# Altium project Invertor_controller_v2.PrjPcb (part 3 of 3)

## Sheet 400vMonitor.SchDoc
size A4
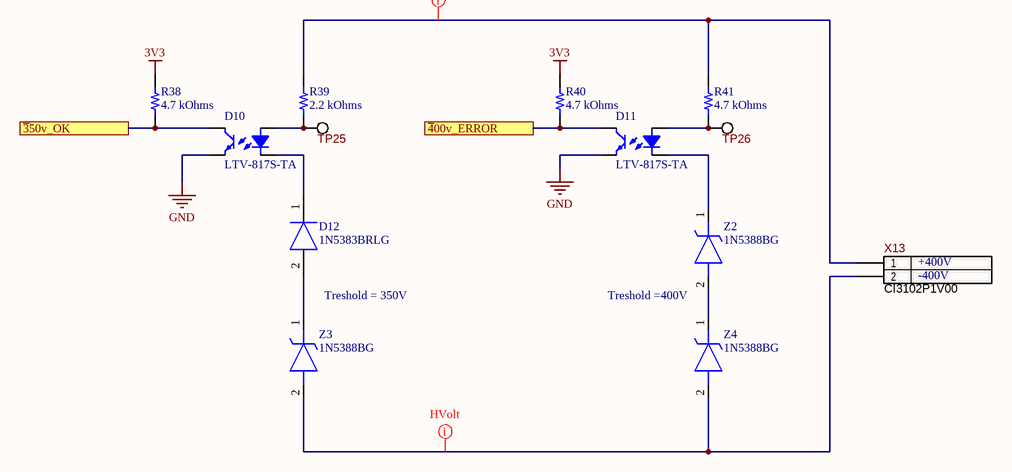
[diagram p9: 400vMonitor.SchDoc]

### Parts
D10  LTV-817S-TA  [LITEON LTV-817]
D11  LTV-817S-TA  [LITEON LTV-817]
D12  1N5383BRLG  [DIOAD2260W109L864D349]
R38  4.7 kOhms  [RES 0805_2012]
R39  2.2 kOhms  [RES 0805_2012]
R40  4.7 kOhms  [RES 0805_2012]
R41  4.7 kOhms  [RES 0805_2012]
TP25  PAD-1.1mm  [PAD-1.1mm]  (value not drawn)  (no BOM)
TP26  PAD-1.1mm  [PAD-1.1mm]  (value not drawn)  (no BOM)
X13  WH-02S  [WF-2S]  (value not drawn)
Z2  1N5388BG  [DIOAD2260W109L864D349]
Z3  1N5388BG  [DIOAD2260W109L864D349]
Z4  1N5388BG  [DIOAD2260W109L864D349]

### Ports
~{3}50v_OK, ~{4}00v_ERROR

### Nets
3V3: R38.2 R40.2
GND: D10.3 D11.3
350V_State: D10.4 R38.1 ; port ~{3}50v_OK
400V_State: D11.4 R40.1 ; port ~{4}00v_ERROR
NetD10_1: D10.1 R39.1 TP25.1
NetD10_2: D10.2 D12.1(K)
NetD11_1: D11.1 R41.1 TP26.1
NetD11_2: D11.2 Z2.1(K)
NetD12_2: D12.2(A) Z3.1(K)
NetR39_2: R39.2 R41.2 X13.1
NetX13_2: X13.2 Z3.2(A) Z4.2(A)
NetZ2_2: Z2.2(A) Z4.1(K)

### Layout directives
net class HVOLT: NetR39_2, NetX13_2

### Notes on the sheet
- (near X13) +400V
- (near X13) -400V
- Treshold = 350V
- Treshold =400V

### Library data of the parts
D10 D11 = LTV-817S-TA: OPTOISOLATR 5KV TRANSISTOR 4-SMD; Manufacturer: Lite-On Inc.; Current - DC Forward (If) (Max): 50mA; Current Transfer Ratio (Max): 600% @ 5mA; Current Transfer Ratio (Min): 50% @ 5mA; Input Type: DC; Number of Channels: 1; Rise / Fall Time (Typ): 4µs, 3µs; Vce Saturation (Max): 200mV; Voltage - Forward (Vf) (Typ): 1.2V; Voltage - Isolation: 5000Vrms; Voltage - Output (Max): 35V; Part Number: LTV-817S-TA; ComponentLink1Description: Datasheet; ComponentLink1URL: http://optoelectronics.liteon.com/upload/download/DS-70-96-0016/LTV-8X7%20series%20201610%20.pdf; ComponentLink2Description: DigiKey Link; ComponentLink2URL: http://digikey.com/product-detail/en/lite-on-inc/LTV-817S-TA/160-2038-1-ND/3711420; Current - Output / Channel: 50mA; Device Package: 4-SMD, Gull Wing; LastUpdated: 12.01.2020 21:59:02; Lifecycle Status: Active; Minimum Order: 1; Mounting Type: Surface Mount; Operating Temperature: -30°C ~ 110°C; Output Type: Transistor; Package / Case: 4-SMD, Gull Wing; Packaging: TapeAndReel; Part Status: Active; Price: 0.12; Series: -; Supplier 1: DigiKey; Supplier Part Number 1: 160-2038-1-ND; Supplier Device Package: 4-SMD
D12 = 1N5383BRLG: Diode; Manufacturer_Name: ON Semiconductor; Datasheet Link: https://datasheet.datasheetarchive.com/originals/distributors/Datasheets-23/DSA-455187.pdf; Manufacturer_Part_Number: 1N5383BRLG; Mouser Part Number: 863-1N5383BRLG; Mouser Price/Stock: https://www.mouser.co.uk/ProductDetail/onsemi/1N5383BRLG?qs=y2kkmE52mdNEksVZLCVE%252BQ%3D%3D; Arrow Part Number: 1N5383BRLG; Arrow Price/Stock: https://www.arrow.com/en/products/1n5383brlg/on-semiconductor
R38 R40 R41 = RCS08054K70JNEA: RES SMD 4.7K OHM 5% 0.4W 0805; Manufacturer: Vishay Dale; Power (Watts): 0.4W, 2/5W; Temperature Coefficient: ±200ppm/°C; Part Number: RCS08054K70JNEA; Value: 4.7 kOhms; ComponentLink1Description: Datasheet; ComponentLink1URL: http://www.vishay.com/docs/20065/rcse3.pdf; ComponentLink2Description: DigiKey Link; ComponentLink2URL: http://digikey.com/product-detail/en/vishay-dale/RCS08054K70JNEA/541-2866-1-ND/5867159; Composition: Thick Film; Device Package: 0805 (2012 Metric); Features: Automotive AEC-Q200, Pulse Withstanding; Height - Seated (Max): 0.020" (0.50mm); LastUpdated: 02.09.2020 01:15:24; Lifecycle Status: Active; Minimum Order: 1; Number of Terminations: 2; Operating Temperature: -55°C ~ 155°C; Package / Case: 0805 (2012 Metric); Packaging: TapeAndReel; PartId: 27839; Part Status: Active; Price: 0.02; Ratings: AEC-Q200; Resistance: 4.7 kOhms; Series: RCS e3; Size / Dimension: 0.079" L x 0.049" W (2.00mm x 1.25mm); Supplier 1: DigiKey; Supplier Part Number 1: 541-2866-1-ND; Supplier Device Package: 0805; Tolerance: ±5%
R39 = SR0805JR-7W2K2L: RES SMD 2.2K OHM 5% 1/4W 0805; Manufacturer: Yageo; Power (Watts): 0.25W, 1/4W; Temperature Coefficient: ±200ppm/°C; Part Number: SR0805JR-7W2K2L; Value: 2.2 kOhms; ComponentLink1Description: Datasheet; ComponentLink1URL: http://www.yageo.com/documents/recent/PYu-SR_20105_RoHS_L_8.pdf; ComponentLink2Description: DigiKey Link; ComponentLink2URL: http://digikey.com/product-detail/en/yageo/SR0805JR-7W2K2L/YAG6054CT-ND/9696508; Composition: Thick Film; Device Package: 0805 (2012 Metric); Features: Automotive AEC-Q200, Pulse Withstanding; Height - Seated (Max): 0.024" (0.60mm); LastUpdated: 02.09.2020 01:15:24; Lifecycle Status: Active; Minimum Order: 1; Number of Terminations: 2; Operating Temperature: -55°C ~ 155°C; Package / Case: 0805 (2012 Metric); Packaging: TapeAndReel; PartId: 27793; Part Status: Active; Price: 0.03; Ratings: AEC-Q200; Resistance: 2.2 kOhms; Series: SR; Size / Dimension: 0.079" L x 0.049" W (2.00mm x 1.25mm); Supplier 1: DigiKey; Supplier Part Number 1: YAG6054CT-ND; Supplier Device Package: 0805; Tolerance: ±5%
TP25 TP26 = PAD-1.1mm: 1.1mm Pad for Plug-In or Receptacle; Ajax_1C_PN: NONE; Ajax_1С_Status: RND Only; Component Status: Released; Lifecycle: ="Lifecycle"; Part Number: PAD-1.1mm; Component Type: PTH; Manufacturer: NONE; Part Type: Pad; Temperature Range: NONE; ComponentLink1URL: NONE; Replacement: NONE; Price: NONE; ComponentLink1Description: Datasheet
X13 = CI3102P1V00: WH Series 2.54mm Wire to Board Straight DIP Type Headers, 2 Pin; Manufacturer: CviLux; Ajax_1C_ID: 6817; Ajax_1C_PN: WF-02S (DS1070-2M) Штекер "папа"; 2 контакта; шаг 2.54мм; прямой; на плату; Ajax_1С_Status: RND Only; Component Status: Released; Replacement: NONE; GUID_1C: 74812bc3-35d6-11e5-ad28-a45d36c4a9e5; Part Number: CI3102P1V00; Part Type: Wire-to-Board / Header; Component Type: PTH; Temperature Range: -25℃ ~ 85℃; ComponentLink1URL: https://www.cvilux.com/uploads/drawings/100/723/CI3102S.pdf; Price: 0.08872458; ComponentLink1Description: Datasheet
Z2-Z4 = 1N5388BG: Zener Diode; Manufacturer_Name: ON Semiconductor; Datasheet Link: https://datasheet.datasheetarchive.com/originals/distributors/SFDatasheet-3/sf-00075052.pdf; Manufacturer_Part_Number: 1N5388BG; Mouser Part Number: 863-1N5388BG; Mouser Price/Stock: https://www.mouser.co.uk/ProductDetail/ON-Semiconductor/1N5388BG?qs=y2kkmE52mdMKKo8v3zoSgw%3D%3D; Arrow Part Number: 1N5388BG; Arrow Price/Stock: https://www.arrow.com/en/products/1n5388bg/on-semiconductor

## Sheet DC-DC_Protection.SchDoc
size A4
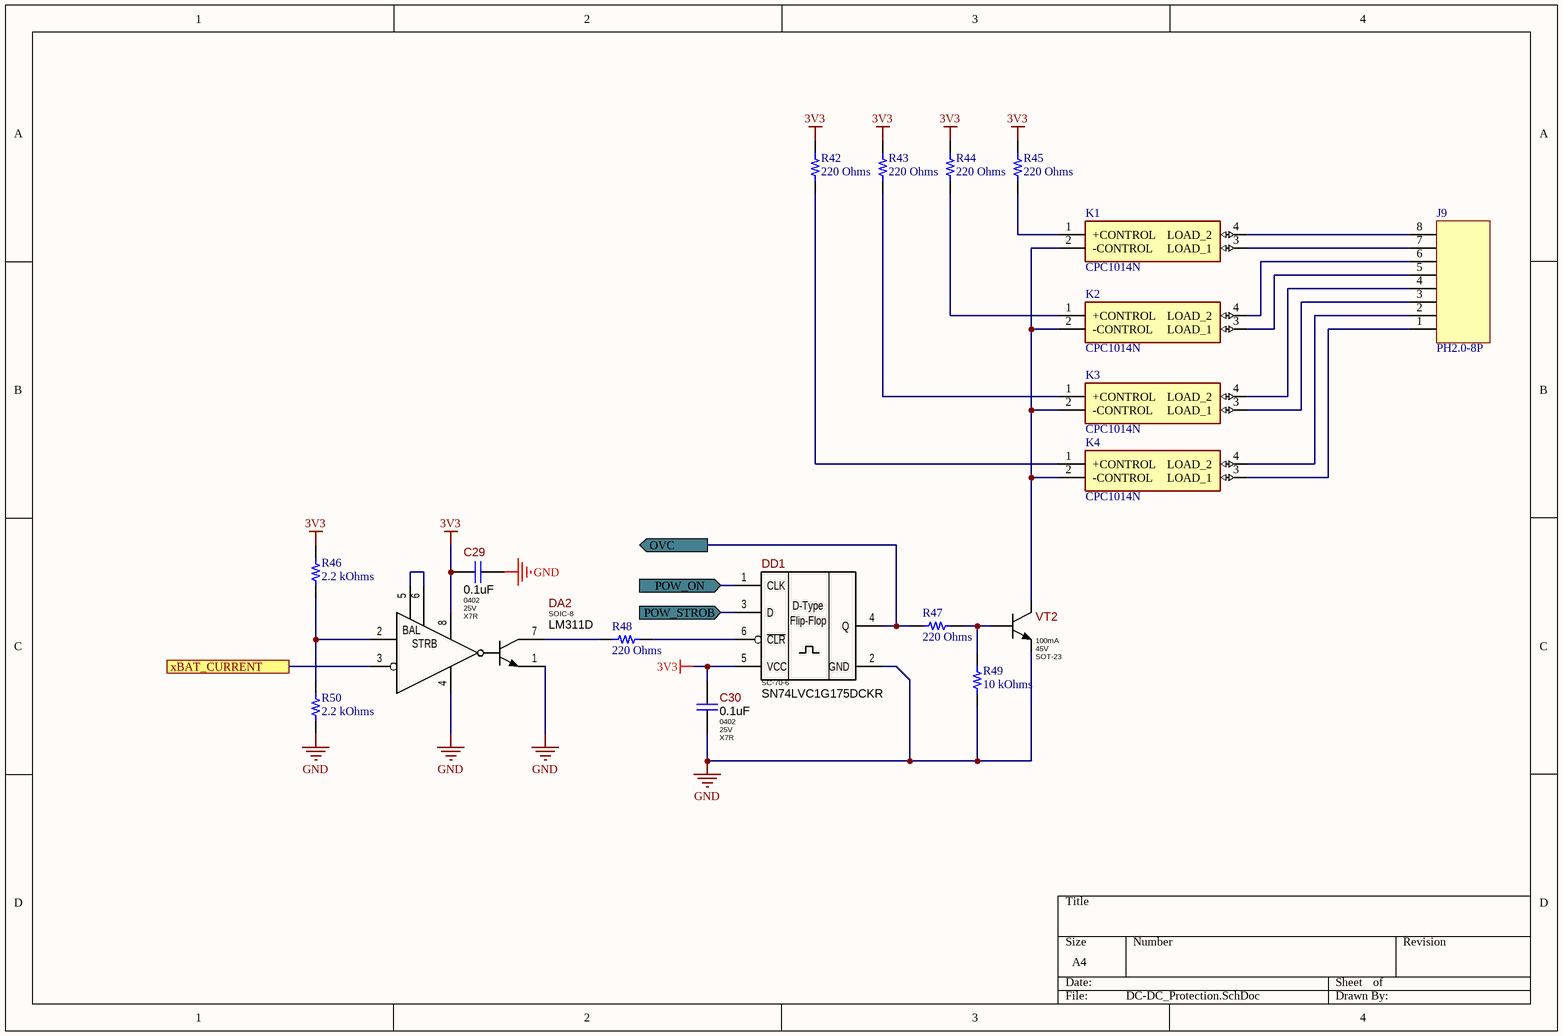
[diagram p10: DC-DC_Protection.SchDoc]

### Parts
C29  Package: 0402  Voltage: 25V  Dielectric Type: X7R  [C_CERAMIC_0402_MED]  (hidden comment: 0.1uF)
C30  Package: 0402  Voltage: 25V  Dielectric Type: X7R  [C_CERAMIC_0402_MED]  (hidden comment: 0.1uF)
DA2  Package: SOIC-8  [SOIC-8_W3.9MM]  (hidden comment: LM311D)
DD1  SN74LVC1G175DCKR  [SC-70-6]
J9  PH2.0-8P  [PH2.0-8P]
K1  CPC1014N  [SOP254P610X218-4N]
K2  CPC1014N  [SOP254P610X218-4N]
K3  CPC1014N  [SOP254P610X218-4N]
K4  CPC1014N  [SOP254P610X218-4N]
R42  220 Ohms  [RES 0805_2012]
R43  220 Ohms  [RES 0805_2012]
R44  220 Ohms  [RES 0805_2012]
R45  220 Ohms  [RES 0805_2012]
R46  2.2 kOhms  [RES 0805_2012]
R47  220 Ohms  [RES 0805_2012]
R48  220 Ohms  [RES 0805_2012]
R49  10 kOhms  [RES 0805_2012]
R50  2.2 kOhms  [RES 0805_2012]
VT2  Ic: 100mA  Vce: 45V  Package: SOT-23  [SOT-23_MED]  (hidden comment: BC847B)

### Ports
OVC (out), POW_ON (in), POW_STROB (in), xBAT_CURRENT

### Nets
3V3: C29.1 C30.1 DA2.8(VCC) DD1.5(VCC) R42.2 R43.2 R44.2 R45.2 R46.2
GND: C29.2 C30.2 DA2.1(EMIT_OUT) DA2.4(GND) DD1.2(GND) R49.1 R50.1 VT2.2(E)
24V_DC_OVC_SIG: DD1.4(Q) R47.1 ; port OVC
cEN_24V: DD1.1(CLK) ; port POW_ON
cPOWER_STROB: DD1.3(D) ; port POW_STROB
xBAT_CURRENT: DA2.3(IN-) ; port xBAT_CURRENT
NetDA2_2: DA2.2(IN+) R46.1 R50.2
NetDA2_5: DA2.5(BALANCE) DA2.6(BAL/STRB)
NetDA2_7: DA2.7(COL_OUT) R48.1
NetDD1_6: DD1.6(~{CLR}) R48.2
NetJ9_1: J9.1 K4.3(LOAD_1)
NetJ9_2: J9.2 K4.4(LOAD_2)
NetJ9_3: J9.3 K3.3(LOAD_1)
NetJ9_4: J9.4 K3.4(LOAD_2)
NetJ9_5: J9.5 K2.3(LOAD_1)
NetJ9_6: J9.6 K2.4(LOAD_2)
NetJ9_7: J9.7 K1.3(LOAD_1)
NetJ9_8: J9.8 K1.4(LOAD_2)
NetK1_1: K1.1(+CONTROL) R45.1
NetK1_2: K1.2(-CONTROL) K2.2(-CONTROL) K3.2(-CONTROL) K4.2(-CONTROL) VT2.3(C)
NetK2_1: K2.1(+CONTROL) R44.1
NetK3_1: K3.1(+CONTROL) R43.1
NetK4_1: K4.1(+CONTROL) R42.1
NetR47_2: R47.2 R49.2 VT2.1(B)

### Notes on the sheet
- (in symbol LM311D) BAL; STRB
- (in symbol SN74LVC1G175DCKR) D-Type; Flip-Flop

### Library data of the parts
C29 C30 = GRM155R71E104KE14D: 100nF 25V X7R ±10% 0402 Ceramic Capacitor RoHS; Manufacturer: Murata Electronics; Ajax_1C_ID: 7993; Ajax_1C_PN: 100nF 25V X7R 10% 0402 GRM155R71E104KE14D Ceramic Capacitor SMD RoHS; Standard Lead Time: 15 Weeks; Replacement: NONE; Value: 0.1uF; Part Number: GRM155R71E104KE14D; Lifecycle: Mass Production; Part Type: Ceramic / X7R / 0402; Component Type: SMD; Temperature Range: -55°C ~ 125°C; Tolerance: ±10%; ComponentLink1URL: https://search.murata.co.jp/Ceramy/image/img/A01X/G101/ENG/GRM155R71E104KE14-01.pdf; Supplier 1: Digi-Key; Supplier Part Number 1: 490-10698-1-ND; ComponentLink1Description: Datasheet
DA2 = LM311D: Differential General Purpose Comparator with Open-Collector, Open-Emitter, SOIC-8; Manufacturer: Texas Instruments; Ajax_1C_ID: 11065; Ajax_1C_PN: LM311D SO8, микросхема; Ajax_1С_Status: RND Only; Standard Lead Time: 6 Weeks; Component Status: On Review; Replacement: NONE; GUID_1C: 9c0f62f0-bfd1-11e7-8199-14dda9d2d04d; Part Number: LM311D; Part Type: Comparator; Component Type: SMD; Temperature Range: 0°C ~ 70°C; ComponentLink1URL: https://www.ti.com/lit/ds/symlink/lm311.pdf; Supplier 1: Digi-Key; Supplier Part Number 1: 296-1388-5-ND; Price: 0.15; ComponentLink1Description: Datasheet
DD1 = SN74LVC1G175DCKR: Single D-type Flip-Flop with Asynchronous Clear, Positive Edge Trigger, SC-70-6; Manufacturer: Texas Instruments; Ajax_1C_ID: 25389; Ajax_1C_PN: SN74LVC1G175DCKR (SC70-6) микросхема; Standard Lead Time: 6 Weeks; Replacement: NONE; Package: SC-70-6; Part Number: SN74LVC1G175DCKR; Part Type: Logic; Component Type: SMD; Lifecycle: RND Only; Temperature Range: -40°C ~ 125°C; ComponentLink1URL: https://www.ti.com/lit/ds/symlink/sn74lvc1g175.pdf?HQS=dis-dk-null-digikeymode-dsf-pf-null-wwe&ts=1622018232841; Supplier 1: Digi-Key; Supplier Part Number 1: 296-16998-2-ND; ComponentLink1Description: Datasheet
K1-K4 = CPC1014N: Relay or Contactor; Manufacturer_Name: LITTELFUSE; Datasheet Link: https://datasheet.datasheetarchive.com/originals/distributors/Datasheets-DGA15/691004.pdf; Height: 2.184mm; Manufacturer_Part_Number: CPC1014N; Mouser Part Number: 849-CPC1014N; Mouser Price/Stock: https://www.mouser.co.uk/ProductDetail/IXYS-Integrated-Circuits/CPC1014N?qs=OpMkDkHXivPNK7%252BhCXwefA%3D%3D; Arrow Part Number: CPC1014N; Arrow Price/Stock: https://www.arrow.com/en/products/cpc1014n/ixys
R42-R45 R47 = ESR10EZPF2200: RES SMD 220 OHM 1% 0.4W 0805; Manufacturer: Rohm Semiconductor; Power (Watts): 0.4W, 2/5W; Temperature Coefficient: ±100ppm/°C; Part Number: ESR10EZPF2200; Value: 220 Ohms; ComponentLink1Description: Datasheet; ComponentLink1URL: https://www.rohm.com/datasheet/ESR01MZPF/esr-e; ComponentLink2Description: DigiKey Link; ComponentLink2URL: http://digikey.com/product-detail/en/rohm-semiconductor/ESR10EZPF2200/RHM220AECT-ND/1983835; Composition: Thick Film; Device Package: 0805 (2012 Metric); Features: Automotive AEC-Q200, Pulse Withstanding; Height - Seated (Max): 0.026" (0.65mm); LastUpdated: 02.09.2020 01:15:23; Lifecycle Status: Active; Minimum Order: 1; Number of Terminations: 2; Operating Temperature: -55°C ~ 155°C; Package / Case: 0805 (2012 Metric); Packaging: TapeAndReel; PartId: 28037; Part Status: Active; Price: 0.02; Ratings: AEC-Q200; Resistance: 220 Ohms; Series: ESR; Size / Dimension: 0.079" L x 0.049" W (2.00mm x 1.25mm); Supplier 1: DigiKey; Supplier Part Number 1: RHM220AECT-ND; Supplier Device Package: 0805; Tolerance: ±1%
R46 R50 = SR0805JR-7W2K2L: as R39 on sheet 400vMonitor; Part Number: SR0805JR-7W2K2L; Value: 2.2 kOhms; ComponentLink1Description: Datasheet; ComponentLink1URL: http://www.yageo.com/documents/recent/PYu-SR_20105_RoHS_L_8.pdf; ComponentLink2Description: DigiKey Link; ComponentLink2URL: http://digikey.com/product-detail/en/yageo/SR0805JR-7W2K2L/YAG6054CT-ND/9696508; Composition: Thick Film; Device Package: 0805 (2012 Metric); Features: Automotive AEC-Q200, Pulse Withstanding; Height - Seated (Max): 0.024" (0.60mm); LastUpdated: 02.09.2020 01:15:24; Lifecycle Status: Active; Minimum Order: 1; Number of Terminations: 2; Operating Temperature: -55°C ~ 155°C; Package / Case: 0805 (2012 Metric); Packaging: TapeAndReel; PartId: 27793; Part Status: Active; Price: 0.03; Ratings: AEC-Q200; Resistance: 2.2 kOhms; Series: SR; Size / Dimension: 0.079" L x 0.049" W (2.00mm x 1.25mm); Supplier 1: DigiKey; Supplier Part Number 1: YAG6054CT-ND; Supplier Device Package: 0805; Tolerance: ±5%
R48 = CRGP0805F220R: CRGP 0805 220R 1%; Manufacturer: TE Connectivity Passive Product; Power (Watts): 0.333W, 1/3W; Temperature Coefficient: ±100ppm/°C; Part Number: CRGP0805F220R; Value: 220 Ohms; ComponentLink1Description: Datasheet; ComponentLink1URL: https://www.te.com/commerce/DocumentDelivery/DDEController?Action=srchrtrv&DocNm=9-1773463-9&DocType=DS&DocLang=English; ComponentLink2Description: DigiKey Link; ComponentLink2URL: http://digikey.com/product-detail/en/te-connectivity-passive-product/CRGP0805F220R/A130469CT-ND/8578301; Composition: Thick Film; Device Package: 0805 (2012 Metric); Features: Pulse Withstanding; Height - Seated (Max): 0.026" (0.65mm); LastUpdated: 02.09.2020 01:15:22; Lifecycle Status: Active; Minimum Order: 1; Number of Terminations: 2; Operating Temperature: -55°C ~ 155°C; Package / Case: 0805 (2012 Metric); Packaging: TapeAndReel; PartId: 28799; Part Status: Active; Price: 0.02; Resistance: 220 Ohms; Series: CRGP; Size / Dimension: 0.079" L x 0.049" W (2.00mm x 1.25mm); Supplier 1: DigiKey; Supplier Part Number 1: A130469CT-ND; Supplier Device Package: 0805; Tolerance: ±1%
R49 = RNCS0805BKE10K0: RES 10K OHM 0.1% 1/10W 0805; Manufacturer: Stackpole Electronics Inc; Power (Watts): 0.1W, 1/10W; Temperature Coefficient: ±25ppm/°C; Part Number: RNCS0805BKE10K0; Value: 10 kOhms; ComponentLink1Description: Datasheet; ComponentLink1URL: https://www.seielect.com/catalog/sei-rncs_rnch.pdf; ComponentLink2Description: DigiKey Link; ComponentLink2URL: http://digikey.com/product-detail/en/stackpole-electronics-inc/RNCS0805BKE10K0/RNCS0805BKE10K0CT-ND/1800164; Composition: Thin Film; Device Package: 0805 (2012 Metric); Features: Anti-Corrosive, Automotive AEC-Q200, Moisture Resistant; Height - Seated (Max): 0.026" (0.65mm); LastUpdated: 02.09.2020 01:15:24; Lifecycle Status: Active; Minimum Order: 1; Number of Terminations: 2; Operating Temperature: -55°C ~ 155°C; Package / Case: 0805 (2012 Metric); Packaging: TapeAndReel; PartId: 27713; Part Status: Active; Price: 0.09; Ratings: AEC-Q200; Resistance: 10 kOhms; Series: RNCS; Size / Dimension: 0.079" L x 0.049" W (2.00mm x 1.25mm); Supplier 1: DigiKey; Supplier Part Number 1: RNCS0805BKE10K0CT-ND; Supplier Device Package: 0805; Tolerance: ±0.1%
VT2 = BC847B,215: 45V, 100mA NPN General Purpose Transistor; Manufacturer: Nexperia USA Inc.; Ajax_1C_PN: NONE; Standard Lead Time: 4 Weeks; Part Type: NPN; Component Type: SMD; Lifecycle: RND Only; Temperature Range: -65°C ~ 150°C; ComponentLink1URL: https://assets.nexperia.com/documents/data-sheet/BC847_SER.pdf; Supplier 1: Digi-Key; Supplier Part Number 1: 1727-2921-2-ND; Replacement: NONE; ComponentLink1Description: Datasheet

## Sheet ULN2003_Drv.SchDoc
size A4
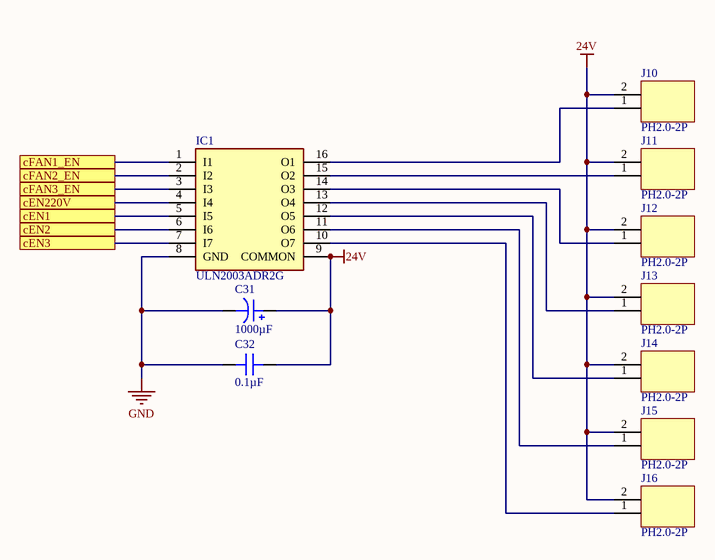
[diagram p11: ULN2003_Drv.SchDoc]

### Parts
C31  1000µF  [CAP TH ALUM ELEC D22.00mm S10.00mm H27.00mm]
C32  0.1µF  [CAP 0805_2012]
IC1  ULN2003ADR2G  [SOIC127P600X175-16N]
J10  PH2.0-2P  [PH2.0-2P]
J11  PH2.0-2P  [PH2.0-2P]
J12  PH2.0-2P  [PH2.0-2P]
J13  PH2.0-2P  [PH2.0-2P]
J14  PH2.0-2P  [PH2.0-2P]
J15  PH2.0-2P  [PH2.0-2P]
J16  PH2.0-2P  [PH2.0-2P]

### Ports
cEN1, cEN2, cEN3, cEN220V, cFAN1_EN, cFAN2_EN, cFAN3_EN

### Nets
24V: C31.1 C32.1 IC1.9(COMMON) J10.2 J11.2 J12.2 J13.2 J14.2 J15.2 J16.2
GND: C31.2 C32.2 IC1.8(GND)
cEN220V: IC1.4(I4) ; port cEN220V
cFAN1_EN: IC1.1(I1) ; port cFAN1_EN
cFAN2_EN: IC1.2(I2) ; port cFAN2_EN
cFAN3_EN: IC1.3(I3) ; port cFAN3_EN
NetIC1_5: IC1.5(I5) ; port cEN1
NetIC1_6: IC1.6(I6) ; port cEN2
NetIC1_7: IC1.7(I7) ; port cEN3
NetIC1_10: IC1.10(O7) J16.1
NetIC1_11: IC1.11(O6) J15.1
NetIC1_12: IC1.12(O5) J14.1
NetIC1_13: IC1.13(O4) J13.1
NetIC1_14: IC1.14(O3) J12.1
NetIC1_15: IC1.15(O2) J11.1
NetIC1_16: IC1.16(O1) J10.1

### Library data of the parts
C31 = LKG1V102MESZCK: CAP ALUM 1000UF 20% 35V SNAP IN; Manufacturer: Nichicon; Lifetime @ Temp.: 1000 Hrs @ 85°C; Polarization: Polar; Ripple Current @ Low Frequency: 1A @ 120Hz; Part Number: LKG1V102MESZCK; Applications: Audio; Capacitance: 1000µF; ComponentLink1Description: Datasheet; ComponentLink1URL: http://nichicon-us.com/english/products/pdfs/e-lkg.pdf; ComponentLink2Description: DigiKey Link; ComponentLink2URL: http://digikey.com/product-detail/en/nichicon/LKG1V102MESZCK/493-17542-ND/7698947; Device Package: Radial, Can - Snap-In; Height - Seated (Max): 1.063" (27.00mm); LastUpdated: 02.09.2020 01:30:15; Lead Spacing: 0.394" (10.00mm); Lifecycle Status: Active; Minimum Order: 1; Mounting Type: Through Hole; Operating Temperature: -40°C ~ 85°C; Package / Case: Radial, Can - Snap-In; Packaging: Bulk; PartId: 10430; Part Status: Active; Price: 4.27; Series: LKG; Size / Dimension: 0.866" Dia (22.00mm); Supplier 1: DigiKey; Supplier Part Number 1: 493-17542-ND; Tolerance: ±20%; Value: 1000µF; Voltage - Rated: 35V
C32 = CC0805MRX7R9BB104: CAP CER 0.1UF 50V X7R 0805; Manufacturer: Yageo; Tolerance: ±20%; Part Number: CC0805MRX7R9BB104; Value: 0.1µF; Applications: General Purpose; Capacitance: 0.1µF; ComponentLink1Description: Datasheet; ComponentLink1URL: https://www.yageo.com/upload/media/product/productsearch/datasheet/mlcc/UPY-GPHC_X7R_6.3V-to-50V_18.pdf; ComponentLink2Description: DigiKey Link; ComponentLink2URL: http://digikey.com/product-detail/en/yageo/CC0805MRX7R9BB104/311-4351-1-ND/8025440; Device Package: 0805 (2012 Metric); LastUpdated: 02.09.2020 01:04:42; Lifecycle Status: Active; Minimum Order: 1; Mounting Type: Surface Mount, MLCC; Operating Temperature: -55°C ~ 125°C; Package / Case: 0805 (2012 Metric); Packaging: TapeAndReel; PartId: 2475; Part Status: Active; Price: 0.02; Series: CC; Size / Dimension: 0.079" L x 0.049" W (2.00mm x 1.25mm); Supplier 1: DigiKey; Supplier Part Number 1: 311-4351-1-ND; Temperature Coefficient: X7R; Thickness (Max): 0.037" (0.95mm); Voltage - Rated: 50V
IC1 = ULN2003ADR2G: Integrated Circuit; Manufacturer_Name: ON Semiconductor; Datasheet Link: http://www.onsemi.com/pub/Collateral/ULN2003A-D.PDF; Height: 1.75mm; Manufacturer_Part_Number: ULN2003ADR2G; Mouser Part Number: 863-ULN2003ADR2G; Mouser Price/Stock: https://www.mouser.co.uk/ProductDetail/onsemi/ULN2003ADR2G?qs=t2BMfLoP1KRgd83C6tnDAg%3D%3D; Arrow Part Number: ULN2003ADR2G; Arrow Price/Stock: https://www.arrow.com/en/products/uln2003adr2g/on-semiconductor?region=nac

## Sheet CPC1014_RELAY.SchDoc
size A4
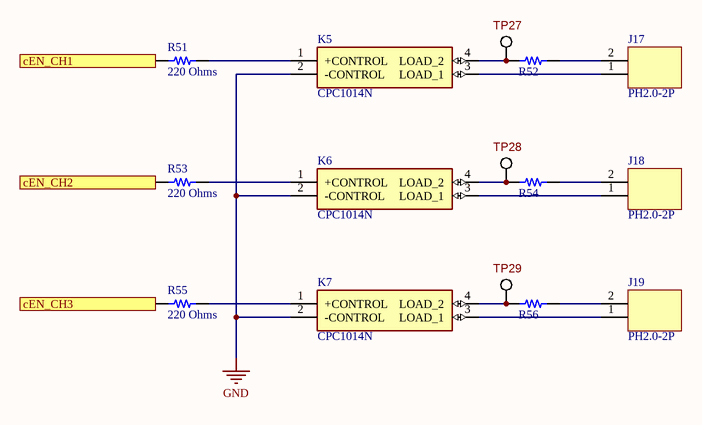
[diagram p12: CPC1014_RELAY.SchDoc]

### Parts
J17  PH2.0-2P  [PH2.0-2P]
J18  PH2.0-2P  [PH2.0-2P]
J19  PH2.0-2P  [PH2.0-2P]
K5  CPC1014N  [SOP254P610X218-4N]
K6  CPC1014N  [SOP254P610X218-4N]
K7  CPC1014N  [SOP254P610X218-4N]
R51  220 Ohms  [RES 0805_2012]
R52  (no value)  [RES 0805_2012]
R53  220 Ohms  [RES 0805_2012]
R54  (no value)  [RES 0805_2012]
R55  220 Ohms  [RES 0805_2012]
R56  (no value)  [RES 0805_2012]
TP27  PAD-1.1mm  [PAD-1.1mm]  (value not drawn)  (no BOM)
TP28  PAD-1.1mm  [PAD-1.1mm]  (value not drawn)  (no BOM)
TP29  PAD-1.1mm  [PAD-1.1mm]  (value not drawn)  (no BOM)

### Ports
cEN_CH1, cEN_CH2, cEN_CH3

### Nets
GND: K5.2(-CONTROL) K6.2(-CONTROL) K7.2(-CONTROL)
cEN_SSR1: R51.2 ; port cEN_CH1
cEN_SSR2: R53.2 ; port cEN_CH2
cEN_SSR3: R55.2 ; port cEN_CH3
NetJ17_1: J17.1 K5.3(LOAD_1)
NetJ17_2: J17.2 R52.2
NetJ18_1: J18.1 K6.3(LOAD_1)
NetJ18_2: J18.2 R54.2
NetJ19_1: J19.1 K7.3(LOAD_1)
NetJ19_2: J19.2 R56.2
NetK5_1: K5.1(+CONTROL) R51.1
NetK5_4: K5.4(LOAD_2) R52.1 TP27.1
NetK6_1: K6.1(+CONTROL) R53.1
NetK6_4: K6.4(LOAD_2) R54.1 TP28.1
NetK7_1: K7.1(+CONTROL) R55.1
NetK7_4: K7.4(LOAD_2) R56.1 TP29.1

### Library data of the parts
K5-K7 = CPC1014N: as K1 on sheet DC-DC_Protection; Datasheet Link: https://datasheet.datasheetarchive.com/originals/distributors/Datasheets-DGA15/691004.pdf; Height: 2.184mm; Manufacturer_Part_Number: CPC1014N; Mouser Part Number: 849-CPC1014N; Mouser Price/Stock: https://www.mouser.co.uk/ProductDetail/IXYS-Integrated-Circuits/CPC1014N?qs=OpMkDkHXivPNK7%252BhCXwefA%3D%3D; Arrow Part Number: CPC1014N; Arrow Price/Stock: https://www.arrow.com/en/products/cpc1014n/ixys
R51 R53 R55 = ESR10EZPF2200: as R42 on sheet DC-DC_Protection; Part Number: ESR10EZPF2200; Value: 220 Ohms; ComponentLink1Description: Datasheet; ComponentLink1URL: https://www.rohm.com/datasheet/ESR01MZPF/esr-e; ComponentLink2Description: DigiKey Link; ComponentLink2URL: http://digikey.com/product-detail/en/rohm-semiconductor/ESR10EZPF2200/RHM220AECT-ND/1983835; Composition: Thick Film; Device Package: 0805 (2012 Metric); Features: Automotive AEC-Q200, Pulse Withstanding; Height - Seated (Max): 0.026" (0.65mm); LastUpdated: 02.09.2020 01:15:23; Lifecycle Status: Active; Minimum Order: 1; Number of Terminations: 2; Operating Temperature: -55°C ~ 155°C; Package / Case: 0805 (2012 Metric); Packaging: TapeAndReel; PartId: 28037; Part Status: Active; Price: 0.02; Ratings: AEC-Q200; Resistance: 220 Ohms; Series: ESR; Size / Dimension: 0.079" L x 0.049" W (2.00mm x 1.25mm); Supplier 1: DigiKey; Supplier Part Number 1: RHM220AECT-ND; Supplier Device Package: 0805; Tolerance: ±1%
R52 R54 R56 = RC0805JR-070RP: RES SMD 0 OHM JUMPER 1/8W 0805; Manufacturer: Yageo; Power (Watts): 0.125W, 1/8W; Part Number: RC0805JR-070RP; ComponentLink1Description: Datasheet; ComponentLink1URL: http://www.yageo.com/NewPortal/yageodocoutput?fileName=/pdf/R-Chip/PYu-RC_51_RoHS_P_0.pdf; ComponentLink2Description: DigiKey Link; ComponentLink2URL: http://digikey.com/product-detail/en/yageo/RC0805JR-070RP/YAG1327CT-ND/4935440; Composition: Thick Film; Device Package: 0805 (2012 Metric); Features: Moisture Resistant; Height - Seated (Max): 0.024" (0.60mm); LastUpdated: 02.09.2020 01:15:23; Lifecycle Status: Active; Minimum Order: 1; Number of Terminations: 2; Operating Temperature: -55°C ~ 155°C; Package / Case: 0805 (2012 Metric); Packaging: TapeAndReel; PartId: 28121; Part Status: Active; Price: 0.01; Series: RC-P Lead Free; Size / Dimension: 0.079" L x 0.049" W (2.00mm x 1.25mm); Supplier 1: DigiKey; Supplier Part Number 1: YAG1327CT-ND; Supplier Device Package: 0805; Tolerance: Jumper
TP27-TP29 = PAD-1.1mm: as TP25 on sheet 400vMonitor; Lifecycle: ="Lifecycle"; Part Number: PAD-1.1mm; Component Type: PTH; Manufacturer: NONE; Part Type: Pad; Temperature Range: NONE; ComponentLink1URL: NONE; Replacement: NONE; Price: NONE; ComponentLink1Description: Datasheet

## Sheet LCD1602_Driver.SchDoc
size A4
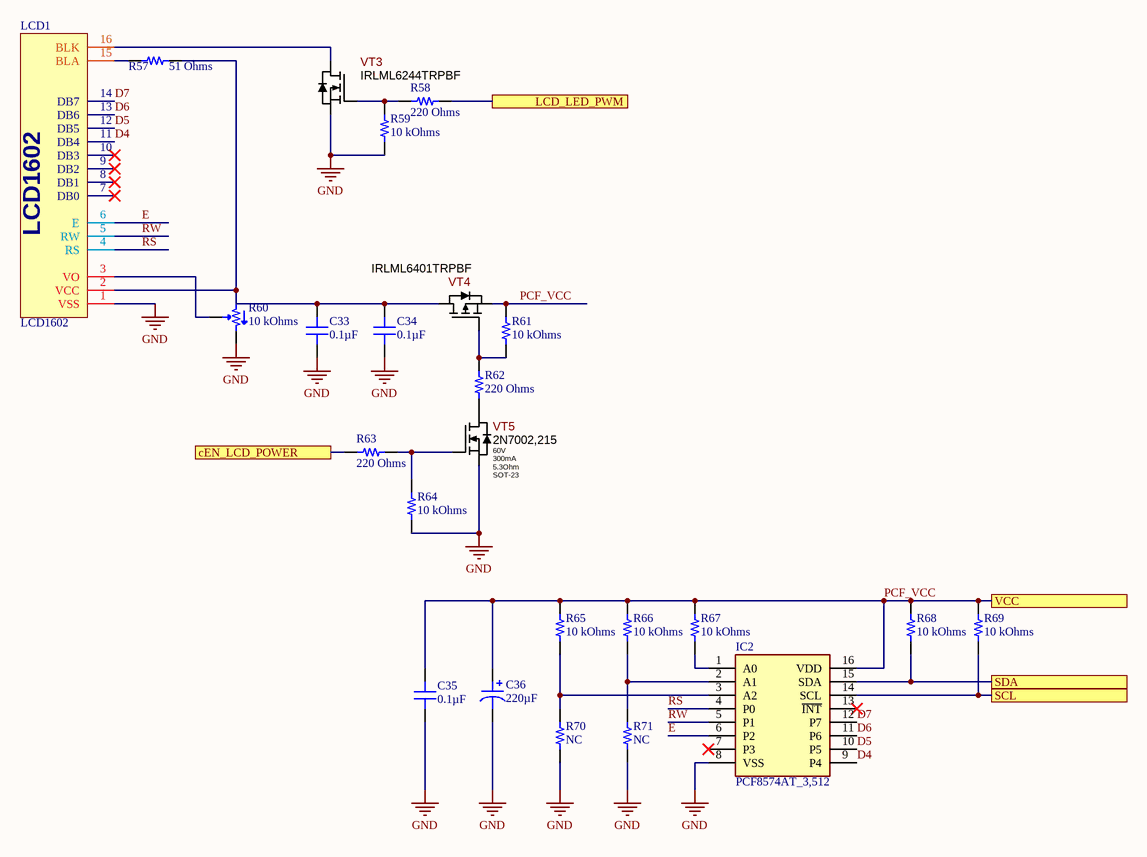
[diagram p13: LCD1602_Driver.SchDoc]

### Parts
C33  0.1µF  [CAP 0805_2012]
C34  0.1µF  [CAP 0805_2012]
C35  0.1µF  [CAP 0805_2012]
C36  220µF  [CAP ALSMD POLY 5.3MM H6.0MM]
IC2  PCF8574AT_3,512  [SOIC127P1032X265-16N]
LCD1  LCD1602  [LCD1602]
R57  51 Ohms  [RES 0805_2012]
R58  220 Ohms  [RES 0805_2012]
R59  10 kOhms  [RES 0805_2012]
R60  10 kOhms  [POT BOURNS TRIMPOT TC33]
R61  10 kOhms  [RES 0805_2012]
R62  220 Ohms  [RES 0805_2012]
R63  220 Ohms  [RES 0805_2012]
R64  10 kOhms  [RES 0805_2012]
R65  10 kOhms  [RES 0805_2012]
R66  10 kOhms  [RES 0805_2012]
R67  10 kOhms  [RES 0805_2012]
R68  10 kOhms  [RES 0805_2012]
R69  10 kOhms  [RES 0805_2012]
R70  NC  [RES 0805_2012]
R71  NC  [RES 0805_2012]
VT3  IRLML6244  [SOT-23_MED]  (value not drawn)
VT4  IRLML6401  [SOT-23_MED]  (value not drawn)
VT5  Vds: 60V  Id: 300mA  Rds: 5.3Ohm  Package: SOT-23  [SOT-23_MED]  (hidden comment: 2N7002)

### Ports
cEN_LCD_POWER, LCD_LED_PWM, SCL, SDA, VCC

### Nets
GND: C33.1 C34.1 C35.1 C36.2 IC2.8(VSS) LCD1.1(VSS) R59.1 R60.3 R64.1 R70.1 R71.1 VT3.2(S) VT5.2(S)
PCF_VCC: C35.2 C36.1 IC2.16(VDD) R61.2 R65.2 R66.2 R67.1 R68.2 R69.1 VT4.2(S) ; port VCC
cLCD_EN: R63.2 ; port cEN_LCD_POWER
cLCD_PWM: R58.1 ; port LCD_LED_PWM
D4: IC2.9(P4) LCD1.11(DB4)
D5: IC2.10(P5) LCD1.12(DB5)
D6: IC2.11(P6) LCD1.13(DB6)
D7: IC2.12(P7) LCD1.14(DB7)
E: IC2.6(P2) LCD1.6(E)
RS: IC2.4(P0) LCD1.4(RS)
RW: IC2.5(P1) LCD1.5(RW)
SCL: IC2.14(SCL) R69.2 ; port SCL
SDA: IC2.15(SDA) R68.1 ; port SDA
NetC33_2: C33.2 C34.2 LCD1.2(VCC) R57.2 R60.1 VT4.3(D)
NetIC2_1: IC2.1(A0) R67.2
NetIC2_2: IC2.2(A1) R66.1 R71.2
NetIC2_3: IC2.3(A2) R65.1 R70.2
NetLCD1_3: LCD1.3(VO) R60.2
NetLCD1_15: LCD1.15(BLA) R57.1
NetLCD1_16: LCD1.16(BLK) VT3.3(D)
NetR58_2: R58.2 R59.2 VT3.1(G)
NetR61_1: R61.1 R62.2 VT4.1(G)
NetR62_1: R62.1 VT5.3(D)
NetR63_1: R63.1 R64.2 VT5.1(G)

Not connected (* = marked no-connect by the designer): IC2 7(P3)* 13(~{INT})*; LCD1 7(DB0)* 8(DB1)* 9(DB2)* 10(DB3)*

### Library data of the parts
C33-C35 = CC0805MRX7R9BB104: as C32 on sheet ULN2003_Drv; Part Number: CC0805MRX7R9BB104; Value: 0.1µF; Applications: General Purpose; Capacitance: 0.1µF; ComponentLink1Description: Datasheet; ComponentLink1URL: https://www.yageo.com/upload/media/product/productsearch/datasheet/mlcc/UPY-GPHC_X7R_6.3V-to-50V_18.pdf; ComponentLink2Description: DigiKey Link; ComponentLink2URL: http://digikey.com/product-detail/en/yageo/CC0805MRX7R9BB104/311-4351-1-ND/8025440; Device Package: 0805 (2012 Metric); LastUpdated: 02.09.2020 01:04:42; Lifecycle Status: Active; Minimum Order: 1; Mounting Type: Surface Mount, MLCC; Operating Temperature: -55°C ~ 125°C; Package / Case: 0805 (2012 Metric); Packaging: TapeAndReel; PartId: 2475; Part Status: Active; Price: 0.02; Series: CC; Size / Dimension: 0.079" L x 0.049" W (2.00mm x 1.25mm); Supplier 1: DigiKey; Supplier Part Number 1: 311-4351-1-ND; Temperature Coefficient: X7R; Thickness (Max): 0.037" (0.95mm); Voltage - Rated: 50V
C36 = 6SVPE220MW: CAP ALUM POLY 220UF 20% 6.3V SMD; Manufacturer: Panasonic Electronic Components; ESR (Equivalent Series Resistance): 15mOhm; Lifetime @ Temp.: 2000 Hrs @ 105°C; Ripple Current @ High Frequency: 3.15A @ 100kHz; Ripple Current @ Low Frequency: 157.5mA @ 120Hz; Surface Mount Land Size: 0.209" L x 0.209" W (5.30mm x 5.30mm); Type: Polymer; Part Number: 6SVPE220MW; Applications: General Purpose; Capacitance: 220µF; ComponentLink1Description: Datasheet; ComponentLink1URL: http://industrial.panasonic.com/www-cgi/jvcr13pz.cgi?E+CI+4+AAB8002+6SVPE220MW+8+WW; ComponentLink2Description: DigiKey Link; ComponentLink2URL: http://digikey.com/product-detail/en/panasonic-electronic-components/6SVPE220MW/P16836CT-ND/4834392; Device Package: Radial, Can - SMD; Height - Seated (Max): 0.236" (6.00mm); LastUpdated: 02.09.2020 01:22:07; Lifecycle Status: Active; Minimum Order: 1; Mounting Type: Surface Mount; Operating Temperature: -55°C ~ 105°C; Package / Case: Radial, Can - SMD; Packaging: TapeAndReel; PartId: 1960; Part Status: Active; Price: 0.20; Series: OS-CON™, SVPE; Size / Dimension: 0.197" Dia (5.00mm); Supplier 1: DigiKey; Supplier Part Number 1: P16836CT-ND; Tolerance: ±20%; Value: 220µF; Voltage - Rated: 6.3V
IC2 = PCF8574AT_3,512: Integrated Circuit; Manufacturer_Name: Nexperia; Manufacturer_Part_Number: PCF8574AT/3,512; Datasheet Link: https://www.nxp.com/docs/en/data-sheet/PCF8574_PCF8574A.pdf; Height: 2.65mm; Mouser Part Number: 771-PCF85AT3512; Mouser Price/Stock: https://www.mouser.com/Search/Refine.aspx?Keyword=771-PCF85AT3512; Arrow Part Number: PCF8574AT/3,512; Arrow Price/Stock: https://www.arrow.com/en/products/pcf8574at3512/nxp-semiconductors
R57 = CRM0805-FX-51R0ELF: RES SMD 51 OHM 1% 1/4W 0805; Manufacturer: Bourns Inc.; Power (Watts): 0.25W, 1/4W; Temperature Coefficient: ±100ppm/°C; Part Number: CRM0805-FX-51R0ELF; Value: 51 Ohms; ComponentLink1Description: Datasheet; ComponentLink1URL: https://www.bourns.com/docs/Product-Datasheets/CRM0805_1206_2010.pdf; ComponentLink2Description: DigiKey Link; ComponentLink2URL: http://digikey.com/product-detail/en/bourns-inc/CRM0805-FX-51R0ELF/CRM0805-FX-51R0ELFCT-ND/3592882; Composition: Thick Film; Device Package: 0805 (2012 Metric); Features: Current Sense; Height - Seated (Max): 0.024" (0.60mm); LastUpdated: 02.09.2020 01:15:23; Lifecycle Status: Active; Minimum Order: 1; Number of Terminations: 2; Operating Temperature: -55°C ~ 155°C; Package / Case: 0805 (2012 Metric); Packaging: TapeAndReel; PartId: 28118; Part Status: Active; Price: 0.01; Resistance: 51 Ohms; Series: CRM0805; Size / Dimension: 0.079" L x 0.047" W (2.00mm x 1.20mm); Supplier 1: DigiKey; Supplier Part Number 1: CRM0805-FX-51R0ELFCT-ND; Supplier Device Package: 0805; Tolerance: ±1%
R58 R62 R63 = CRGP0805F220R: as R48 on sheet DC-DC_Protection; Part Number: CRGP0805F220R; Value: 220 Ohms; ComponentLink1Description: Datasheet; ComponentLink1URL: https://www.te.com/commerce/DocumentDelivery/DDEController?Action=srchrtrv&DocNm=9-1773463-9&DocType=DS&DocLang=English; ComponentLink2Description: DigiKey Link; ComponentLink2URL: http://digikey.com/product-detail/en/te-connectivity-passive-product/CRGP0805F220R/A130469CT-ND/8578301; Composition: Thick Film; Device Package: 0805 (2012 Metric); Features: Pulse Withstanding; Height - Seated (Max): 0.026" (0.65mm); LastUpdated: 02.09.2020 01:15:22; Lifecycle Status: Active; Minimum Order: 1; Number of Terminations: 2; Operating Temperature: -55°C ~ 155°C; Package / Case: 0805 (2012 Metric); Packaging: TapeAndReel; PartId: 28799; Part Status: Active; Price: 0.02; Resistance: 220 Ohms; Series: CRGP; Size / Dimension: 0.079" L x 0.049" W (2.00mm x 1.25mm); Supplier 1: DigiKey; Supplier Part Number 1: A130469CT-ND; Supplier Device Package: 0805; Tolerance: ±1%
R59 R61 R64-R69 = RNCS0805BKE10K0: as R49 on sheet DC-DC_Protection; Part Number: RNCS0805BKE10K0; Value: 10 kOhms; ComponentLink1Description: Datasheet; ComponentLink1URL: https://www.seielect.com/catalog/sei-rncs_rnch.pdf; ComponentLink2Description: DigiKey Link; ComponentLink2URL: http://digikey.com/product-detail/en/stackpole-electronics-inc/RNCS0805BKE10K0/RNCS0805BKE10K0CT-ND/1800164; Composition: Thin Film; Device Package: 0805 (2012 Metric); Features: Anti-Corrosive, Automotive AEC-Q200, Moisture Resistant; Height - Seated (Max): 0.026" (0.65mm); LastUpdated: 02.09.2020 01:15:24; Lifecycle Status: Active; Minimum Order: 1; Number of Terminations: 2; Operating Temperature: -55°C ~ 155°C; Package / Case: 0805 (2012 Metric); Packaging: TapeAndReel; PartId: 27713; Part Status: Active; Price: 0.09; Ratings: AEC-Q200; Resistance: 10 kOhms; Series: RNCS; Size / Dimension: 0.079" L x 0.049" W (2.00mm x 1.25mm); Supplier 1: DigiKey; Supplier Part Number 1: RNCS0805BKE10K0CT-ND; Supplier Device Package: 0805; Tolerance: ±0.1%
R60 = TC33X-2-103E: TRIMMER 10K OHM 0.1W J LEAD TOP; Manufacturer: Bourns Inc.; Adjustment Type: Top Adjustment; Number of Turns: 1; Power (Watts): 0.1W, 1/10W; Resistive Material: Cermet; Temperature Coefficient: ±250ppm/°C; Tolerance: ±25%; Part Number: TC33X-2-103E; ComponentLink1Description: Datasheet; ComponentLink1URL: https://www.bourns.com/docs/Product-Datasheets/TC33.pdf; ComponentLink2Description: DigiKey Link; ComponentLink2URL: http://digikey.com/product-detail/en/bourns-inc/TC33X-2-103E/TC33X-103ECT-ND/612911; LastUpdated: 02.09.2020 01:21:42; Lifecycle Status: Active; Minimum Order: 1; Mounting Type: Surface Mount; Packaging: TapeAndReel; PartId: 8; Part Status: Active; Price: 0.15; Resistance: 10 kOhms; Series: Trimpot® TC33 - Open Frame; Size / Dimension: Rectangular - 0.150" x 0.142" Face x 0.047" H (3.80mm x 3.60mm x 1.20mm); Supplier 1: DigiKey; Supplier Part Number 1: TC33X-103ECT-ND; Termination Style: J Lead; Value: 10 kOhms
R70 R71 = RNCS0805BKE10K0: RES 10K OHM 0.1% 1/10W 0805; Manufacturer: Stackpole Electronics Inc; Power (Watts): 0.1W, 1/10W; Resistance: 10 kOhms; Temperature Coefficient: ±25ppm/°C; Part Number: RNCS0805BKE10K0; Value: NC; ComponentLink1Description: Datasheet; ComponentLink1URL: https://www.seielect.com/catalog/sei-rncs_rnch.pdf; ComponentLink2Description: DigiKey Link; ComponentLink2URL: http://digikey.com/product-detail/en/stackpole-electronics-inc/RNCS0805BKE10K0/RNCS0805BKE10K0CT-ND/1800164; Composition: Thin Film; Device Package: 0805 (2012 Metric); Features: Anti-Corrosive, Automotive AEC-Q200, Moisture Resistant; Height - Seated (Max): 0.026" (0.65mm); LastUpdated: 02.09.2020 01:15:24; Lifecycle Status: Active; Minimum Order: 1; Number of Terminations: 2; Operating Temperature: -55°C ~ 155°C; Package / Case: 0805 (2012 Metric); Packaging: TapeAndReel; PartId: 27713; Part Status: Active; Price: 0.09; Ratings: AEC-Q200; Series: RNCS; Size / Dimension: 0.079" L x 0.049" W (2.00mm x 1.25mm); Supplier 1: DigiKey; Supplier Part Number 1: RNCS0805BKE10K0CT-ND; Supplier Device Package: 0805; Tolerance: ±0.1%
VT3 = IRLML6244TRPBF: 20V, 6.3A max N-Channel HEXFET MOSFET, 21mOhm @ Vgs = 4.5V; Manufacturer: Infineon Technologies; Rds: 27mOhm; Ajax_1C_ID: 5903; Ajax_1C_PN: IRLML6244TRPBF. полевой транзистор; Ajax_1С_Status: Mass Production; Component Status: Released; Standard Lead Time: 15 Weeks; Replacement: NONE; GUID_1C: 6032e646-a6d2-11e4-9c1d-a45d36c4a9e5; Part Number: IRLML6244TRPBF; Vds: 20V; Id: 6.3A; Package: SOT-23; Part Type: N-Channel; Component Type: SMD; Temperature Range: -55°C ~ 150°C; ComponentLink1URL: https://www.infineon.com/dgdl/irlml6244pbf.pdf?fileId=5546d462533600a4015356686fed261f; Supplier 1: Digi-Key; Supplier Part Number 1: IRLML6244TRPBFTR-ND; Price: 0,05; ComponentLink1Description: Datasheet
VT4 = IRLML6401TRPBF: -12V, -4.3A max P-Channel HEXFET MOSFET, 50mOhm @ Vgs = -4.5V; Manufacturer: Infineon Technologies; Vds: 12V; Id: 4.3A; Rds: 125mOhm; Ajax_1C_ID: 6278; Ajax_1C_PN: IRLML6401TRPBF SOT23. полевой транзистор; Ajax_1С_Status: Mass Production; Component Status: Released; Standard Lead Time: 15 Weeks; Replacement: NONE; GUID_1C: 6c71c7cd-df67-11e4-9f89-a45d36c4a9e5; Part Number: IRLML6401TRPBF; Package: SOT-23; Part Type: P-Channel; Component Type: SMD; Temperature Range: -55°C ~ 150°C; ComponentLink1URL: https://www.infineon.com/dgdl/irlml6401pbf.pdf?fileId=5546d462533600a401535668b96d2634; Supplier 1: Digi-Key; Supplier Part Number 1: IRLML6401PBFCT-ND; Price: 0,051; ComponentLink1Description: Datasheet
VT5 = 2N7002,215: 60V, 300mA max N-Channel Trench MOSFET, 3.8Ohm @ Vgs = 4.5V; Manufacturer: Nexperia USA Inc.; Ajax_1C_ID: 8875; Ajax_1C_PN: 2N7002.215 , NXP полевой транзистор; Ajax_1С_Status: Mass Production; Component Status: Released; Standard Lead Time: 4 Weeks; Replacement: NONE; GUID_1C: 4d2e7416-6b97-11e6-8203-d8cb8a9acc66; Part Type: N-Channel; Component Type: SMD; Temperature Range: -65°C ~ 150°C; ComponentLink1URL: https://assets.nexperia.com/documents/data-sheet/2N7002.pdf; Supplier 1: Digi-Key; Supplier Part Number 1: 1727-2764-2-ND; Price: 0,03; ComponentLink1Description: Datasheet; Part Number: 2N7002,215

## Sheet Buttons_Buzzer.SchDoc
size A4
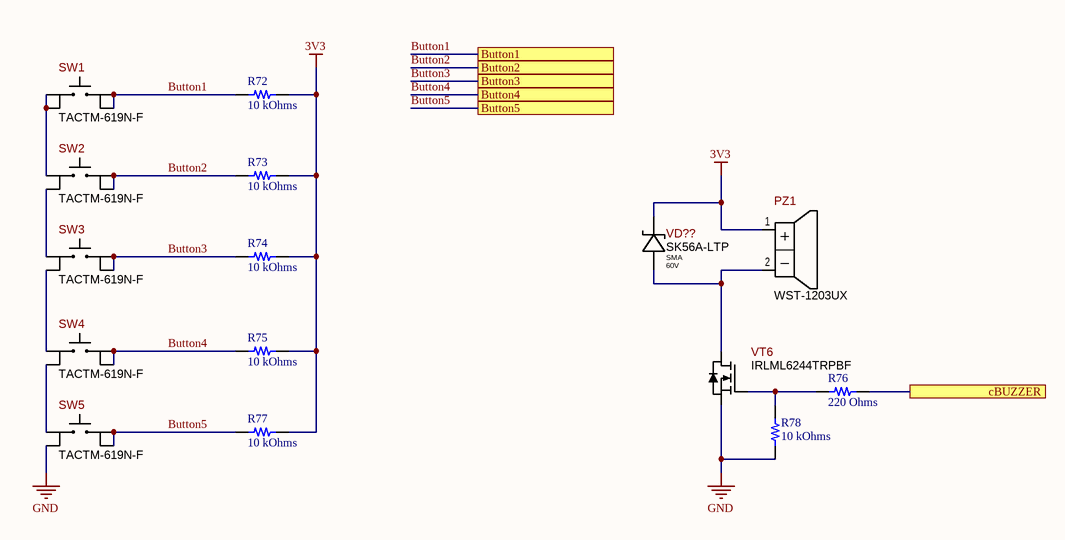
[diagram p14: Buttons_Buzzer.SchDoc]

### Parts
PZ1  WST-1203UX  [WST-1203UX]
R72  10 kOhms  [RES 0805_2012]
R73  10 kOhms  [RES 0805_2012]
R74  10 kOhms  [RES 0805_2012]
R75  10 kOhms  [RES 0805_2012]
R76  220 Ohms  [RES 0805_2012]
R77  10 kOhms  [RES 0805_2012]
R78  10 kOhms  [RES 0805_2012]
SW1  TACTM-619N-F  [TACTM-619N-F]
SW2  TACTM-619N-F  [TACTM-619N-F]
SW3  TACTM-619N-F  [TACTM-619N-F]
SW4  TACTM-619N-F  [TACTM-619N-F]
SW5  TACTM-619N-F  [TACTM-619N-F]
VD??  Package: SMA  Voltage: 60V  [SMA_MED]  (hidden comment: SK56A-LTP)
VT6  IRLML6244  [SOT-23_MED]  (value not drawn)

### Ports
Button1, Button2, Button3, Button4, Button5, cBUZZER

### Nets
3V3: PZ1.1(Positive) R72.1 R73.1 R74.1 R75.1 R77.1 VD??.CA
GND: R78.1 SW5.2 VT6.2(S)
Button1: R72.2 SW1.3 SW1.4 ; port Button1
Button2: R73.2 SW2.3 SW2.4 ; port Button2
Button3: R74.2 SW3.3 SW3.4 ; port Button3
Button4: R75.2 SW4.3 SW4.4 ; port Button4
Button5: R77.2 SW5.3 SW5.4 ; port Button5
cBUZZER: R76.1 ; port cBUZZER
NetPZ1_2: PZ1.2(Negative) VD??.AN VT6.3(D)
NetR76_2: R76.2 R78.2 VT6.1(G)
NetSW1_1: SW1.1 SW1.2 SW2.1
NetSW2_2: SW2.2 SW3.1
NetSW3_2: SW3.2 SW4.1
NetSW4_2: SW4.2 SW5.1

### Library data of the parts
PZ1 = WST-1203UX: Buzzers Indicator, Internally Driven Magnetic 3V 30mA 2.3kHz 82dB @ 3V, 10cm Through Hole; Manufacturer: Soberton; Ajax_1C_PN: NONE; Ajax_1С_Status: RND Only; Component Status: Released; Part Type: Buzzer; Component Type: PTH; Temperature Range: -20°C ~ 60°C; ComponentLink1URL: https://www.soberton.com/wp-content/uploads/2019/02/WST-1203UX.-17-Feb-2019-pdf.pdf; Supplier 1: Digi-Key; Supplier Part Number 1: 433-1047-ND; Replacement: NONE; Price: NONE; ComponentLink1Description: Datasheet; Part Number: WST-1203UX
R72-R75 R77 R78 = RNCS0805BKE10K0: as R49 on sheet DC-DC_Protection; Part Number: RNCS0805BKE10K0; Value: 10 kOhms; ComponentLink1Description: Datasheet; ComponentLink1URL: https://www.seielect.com/catalog/sei-rncs_rnch.pdf; ComponentLink2Description: DigiKey Link; ComponentLink2URL: http://digikey.com/product-detail/en/stackpole-electronics-inc/RNCS0805BKE10K0/RNCS0805BKE10K0CT-ND/1800164; Composition: Thin Film; Device Package: 0805 (2012 Metric); Features: Anti-Corrosive, Automotive AEC-Q200, Moisture Resistant; Height - Seated (Max): 0.026" (0.65mm); LastUpdated: 02.09.2020 01:15:24; Lifecycle Status: Active; Minimum Order: 1; Number of Terminations: 2; Operating Temperature: -55°C ~ 155°C; Package / Case: 0805 (2012 Metric); Packaging: TapeAndReel; PartId: 27713; Part Status: Active; Price: 0.09; Ratings: AEC-Q200; Resistance: 10 kOhms; Series: RNCS; Size / Dimension: 0.079" L x 0.049" W (2.00mm x 1.25mm); Supplier 1: DigiKey; Supplier Part Number 1: RNCS0805BKE10K0CT-ND; Supplier Device Package: 0805; Tolerance: ±0.1%
R76 = CRGP0805F220R: as R48 on sheet DC-DC_Protection; Part Number: CRGP0805F220R; Value: 220 Ohms; ComponentLink1Description: Datasheet; ComponentLink1URL: https://www.te.com/commerce/DocumentDelivery/DDEController?Action=srchrtrv&DocNm=9-1773463-9&DocType=DS&DocLang=English; ComponentLink2Description: DigiKey Link; ComponentLink2URL: http://digikey.com/product-detail/en/te-connectivity-passive-product/CRGP0805F220R/A130469CT-ND/8578301; Composition: Thick Film; Device Package: 0805 (2012 Metric); Features: Pulse Withstanding; Height - Seated (Max): 0.026" (0.65mm); LastUpdated: 02.09.2020 01:15:22; Lifecycle Status: Active; Minimum Order: 1; Number of Terminations: 2; Operating Temperature: -55°C ~ 155°C; Package / Case: 0805 (2012 Metric); Packaging: TapeAndReel; PartId: 28799; Part Status: Active; Price: 0.02; Resistance: 220 Ohms; Series: CRGP; Size / Dimension: 0.079" L x 0.049" W (2.00mm x 1.25mm); Supplier 1: DigiKey; Supplier Part Number 1: A130469CT-ND; Supplier Device Package: 0805; Tolerance: ±1%
SW1-SW5 = TACTM-619N-F: Tactile Switch SPST-NO 50mA 12V, 19mm Height; Manufacturer: Ninigi; Ajax_1C_ID: 20595; Ajax_1C_PN: Кнопка тактовая TACTM-619N-F; Ajax_1С_Status: RND Only; Component Status: On Review; Replacement: NONE; GUID_1C: 8084fd23-9e98-11ea-ab61-0050569f2651; Part Number: TACTM-619N-F; Part Type: Tactile Switch; Component Type: SMD; Temperature Range: -30°C ~ 85°C; ComponentLink1URL: https://www.tme.eu/Document/4775f6520ae2603ad81b86e79483fd89/TACTM-619N-F-DTE.pdf; Supplier 1: TME; Supplier Part Number 1: TACTM-619N-F; Price: 0,0953462; ComponentLink1Description: Datasheet
VD?? = SK56A-LTP: Diode Schottky 60V 5A, SMA; Manufacturer: Micro Commercial Co; Ajax_1C_ID: 12747; Ajax_1C_PN: SK56A-LTP диод; Ajax_1С_Status: Mass Production; Marking: SK56A; Component Status: Released; Standard Lead Time: 12 Weeks; Vf: 750mV @ 5A; Replacement: NONE; GUID_1C: b92aa543-5aa4-11e8-ab3c-0050569f2651; Part Number: SK56A-LTP; Part Type: Schottky; Component Type: SMD; Current: 5A; Temperature Range: -55°C ~ 150°C; ComponentLink1URL: https://www.mccsemi.com/pdf/Products/SK52A-L-SK510A-L(DO-214AC).pdf; Supplier 1: Digi-Key; Supplier Part Number 1: SK56A-LTPMSTR-ND; Price: 0,06; ComponentLink1Description: Datasheet
VT6 = IRLML6244TRPBF: as VT3 on sheet LCD1602_Driver; Part Number: IRLML6244TRPBF; Vds: 20V; Id: 6.3A; Package: SOT-23; Part Type: N-Channel; Component Type: SMD; Temperature Range: -55°C ~ 150°C; ComponentLink1URL: https://www.infineon.com/dgdl/irlml6244pbf.pdf?fileId=5546d462533600a4015356686fed261f; Supplier 1: Digi-Key; Supplier Part Number 1: IRLML6244TRPBFTR-ND; Price: 0,05; ComponentLink1Description: Datasheet

## Nets that join several sheets
3V3: MCU (7 pins), Designator (D1_Designator.2), Power (6 pins), Designator (D4_Designator#1.2), Designator (D4_Designator#2.2), ShuntAmplifier (AT1.5 C28.1 D5.2), FusesControl (R18.2 R20.2 R22.2 R24.2), NTC_MUX (8 pins), Designator/Designator (D1_Designator_Designator.2), 400vMonitor (R38.2 R40.2), DC-DC_Protection (9 pins), Designator (D4_Designator#3.2), Designator (D4_Designator#4.2), Buttons_Buzzer (7 pins)
24V: Power (12 pins), FusesControl (R17.2 R19.2 R21.2 R23.2), GatesDriver (R25.1 R26.2 Z1.1), ULN2003_Drv (10 pins)
GND: main (X6.1 X7.1 X11.1 X12.1), MCU (19 pins), Designator (5 pins), Power (29 pins), Designator (C25_Designator#1.1 D4_Designator#1.1 R13_Designator#1.1), Designator (C25_Designator#2.1 D4_Designator#2.1 R13_Designator#2.1), ShuntAmplifier (AT1.2 C27.1 C28.2 D5.1), FusesControl (D6.3 D7.3 D8.3 D9.3), GatesDriver (Q1.2 R29.1), NTC_MUX (8 pins), Designator/Designator (5 pins), 400vMonitor (D10.3 D11.3), DC-DC_Protection (8 pins), ULN2003_Drv (C31.2 C32.2 IC1.8), Designator (C25_Designator#3.1 D4_Designator#3.1 R13_Designator#3.1), Designator (C25_Designator#4.1 D4_Designator#4.1 R13_Designator#4.1), CPC1014_RELAY (K5.2 K6.2 K7.2), LCD1602_Driver (13 pins), Buttons_Buzzer (R78.1 SW5.2 VT6.2)
PCF_VCC: MCU (X1.2 X2.1), Designator (C1_Designator.1 U1_Designator.16), Power (7 pins), Designator/Designator (C1_Designator_Designator.1 U1_Designator_Designator.16), LCD1602_Driver (10 pins)
24V_BAT: main (X6.2), Designator (R12_Designator#1.1)
24V_DC_OVC_SIG: MCU (U2.39), DC-DC_Protection (DD1.4 R47.1)
350V_State: MCU (U2.62), 400vMonitor (D10.4 R38.1)
400V_State: MCU (U2.29), 400vMonitor (D11.4 R40.1)
AIN0: Designator (U1_Designator.13), Designator (C25_Designator#1.2 D4_Designator#1.3 R12_Designator#1.2 R13_Designator#1.2)
AIN1: Designator (U1_Designator.14), Designator (C25_Designator#2.2 D4_Designator#2.3 R12_Designator#2.2 R13_Designator#2.2)
AIN3: Designator (U1_Designator.12), Designator (C25_Designator#3.2 D4_Designator#3.3 R12_Designator#3.2 R13_Designator#3.2)
AIN4: Designator (U1_Designator.1), Designator (C25_Designator#4.2 D4_Designator#4.3 R12_Designator#4.2 R13_Designator#4.2)
Button1: MCU (U2.61), Buttons_Buzzer (R72.2 SW1.3 SW1.4)
Button2: MCU (U2.54), Buttons_Buzzer (R73.2 SW2.3 SW2.4)
Button3: MCU (U2.50), Buttons_Buzzer (R74.2 SW3.3 SW3.4)
Button4: MCU (U2.45), Buttons_Buzzer (R75.2 SW4.3 SW4.4)
Button5: MCU (U2.44), Buttons_Buzzer (R77.2 SW5.3 SW5.4)
c24V_EN: MCU (U2.30), GatesDriver (R28.1)
cBUZZER: MCU (U2.23), Buttons_Buzzer (R76.1)
cEN220V: MCU (U2.53), ULN2003_Drv (IC1.4)
cEN_24V: MCU (U2.21), DC-DC_Protection (DD1.1)
cEN_SSR1: MCU (U2.26), CPC1014_RELAY (R51.2)
cEN_SSR2: MCU (U2.27), CPC1014_RELAY (R53.2)
cEN_SSR3: MCU (U2.28), CPC1014_RELAY (R55.2)
cFAN1_EN: MCU (U2.2), ULN2003_Drv (IC1.1)
cFAN2_EN: MCU (U2.3), ULN2003_Drv (IC1.2)
cFAN3_EN: MCU (U2.4), ULN2003_Drv (IC1.3)
cLCD_EN: MCU (U2.55), LCD1602_Driver (R63.2)
cLCD_PWM: MCU (U2.56), LCD1602_Driver (R58.1)
cMUX0~{E}N: MCU (U2.11), Designator (U1_Designator.6)
cMUX0SEL0: MCU (U2.8), Designator (U1_Designator.11)
cMUX0SEL1: MCU (U2.9), Designator (U1_Designator.10)
cMUX0SEL2: MCU (U2.10), Designator (U1_Designator.9)
cNTC_MUX_EN: MCU (U2.38), Designator/Designator (U1_Designator_Designator.6)
cNTC_SEL0: MCU (U2.24), Designator/Designator (U1_Designator_Designator.11)
cNTC_SEL1: MCU (U2.25), Designator/Designator (U1_Designator_Designator.10)
cNTC_SEL2: MCU (U2.37), Designator/Designator (U1_Designator_Designator.9)
cPOWER_STROB: MCU (U2.22), DC-DC_Protection (DD1.3)
F1_STATE: MCU (U2.33), FusesControl (D6.4 R18.1)
F2_STATE: MCU (U2.34), FusesControl (D7.4 R20.1)
F3_STATE: MCU (U2.35), FusesControl (D8.4 R22.1)
F4_STATE: MCU (U2.36), FusesControl (D9.4 R24.1)
NetD6_2: main (X9.4), FusesControl (D6.2)
NetD7_2: main (X9.3), FusesControl (D7.2)
NetD8_2: main (X9.2), FusesControl (D8.2)
NetD9_2: main (X9.1), FusesControl (D9.2)
NetIC1_5: main (TP19.1), ULN2003_Drv (IC1.5)
NetIC1_6: main (TP20.1), ULN2003_Drv (IC1.6)
NetIC1_7: main (TP21.1), ULN2003_Drv (IC1.7)
NetJ1_1: NTC_MUX (J1.1 R30.2), Designator/Designator (U1_Designator_Designator.13)
NetJ2_1: NTC_MUX (J2.1 R31.2), Designator/Designator (U1_Designator_Designator.14)
NetJ3_1: NTC_MUX (J3.1 R32.2), Designator/Designator (U1_Designator_Designator.15)
NetJ4_1: NTC_MUX (J4.1 R33.2), Designator/Designator (U1_Designator_Designator.12)
NetJ5_1: NTC_MUX (J5.1 R34.2), Designator/Designator (U1_Designator_Designator.1)
NetJ6_1: NTC_MUX (J6.1 R35.2), Designator/Designator (U1_Designator_Designator.5)
NetJ7_1: NTC_MUX (J7.1 R36.2), Designator/Designator (U1_Designator_Designator.4)
NetJ8_1: NTC_MUX (J8.1 R37.2), Designator/Designator (U1_Designator_Designator.2)
NetR12_Designator#3_1: main (X11.2), Designator (R12_Designator#3.1)
NetR12_Designator#4_1: main (X12.2), Designator (R12_Designator#4.1)
NetR25_2: main (X10.2), GatesDriver (R25.2)
NetR26_1: main (X10.1), GatesDriver (R26.1 R27.2 TP22.1 Z1.2)
NetTP4_1: main (TP4.1), MCU (U2.20)
NetTP16_1: main (TP16.1), Designator (U1_Designator.5)
NetTP17_1: main (TP17.1), Designator (U1_Designator.2)
NetTP18_1: main (TP18.1), Designator (U1_Designator.4)
PA0: MCU (U2.14), Designator (C2_Designator.2 D1_Designator.3 R1_Designator.1)
PA1: MCU (U2.15), Designator/Designator (C2_Designator_Designator.2 D1_Designator_Designator.3 R1_Designator_Designator.1)
SHUNT+: main (X8.2), ShuntAmplifier (R14.1)
SHUNT-: main (X8.1), ShuntAmplifier (R16.1)
x24V_DC_AC: main (X7.2), Designator (R12_Designator#2.1)
xBAT_CURRENT: Designator (U1_Designator.15), ShuntAmplifier (C27.2 D5.3 R15.2), DC-DC_Protection (DA2.3)